# Altium schematic sheet ESP_AutoFlasher.SchDoc
size A4
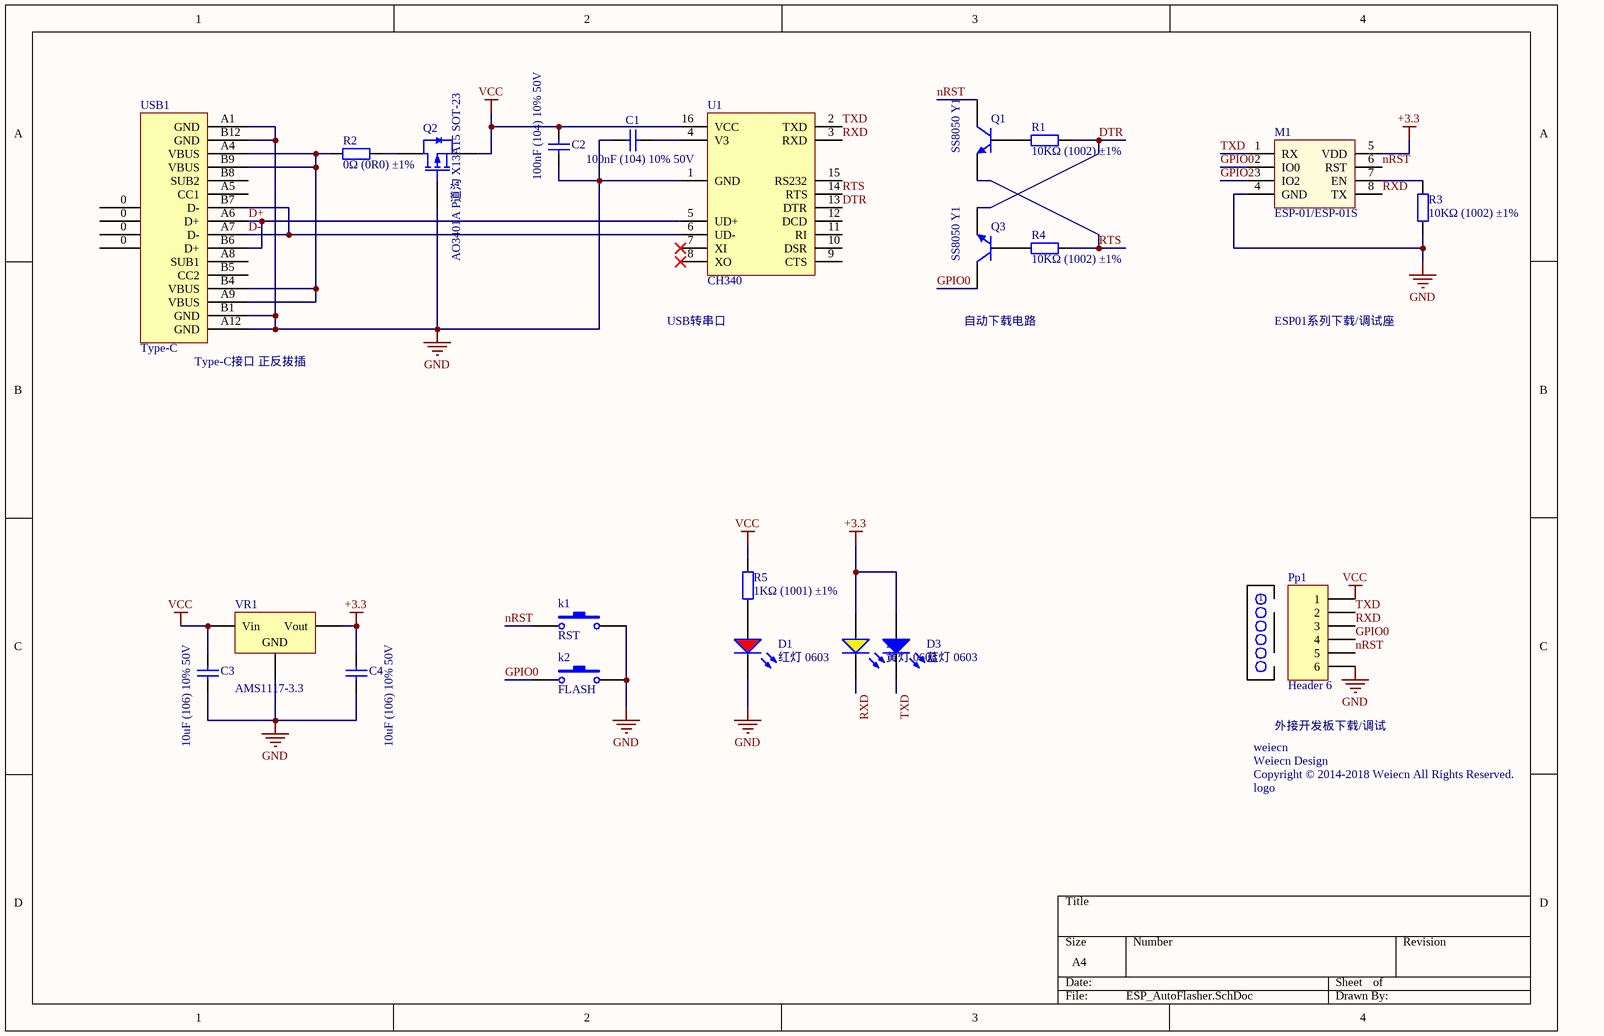
[diagram p0: ESP_AutoFlasher.SchDoc]

## Parts
C1  100nF (104) 10% 50V  [0603_C]
C2  100nF (104) 10% 50V  [0603_C]
C3  10uF (106) 10% 50V  [1206_C]
C4  10uF (106) 10% 50V  [1206_C]
D1  红灯 0603  [0603_LED_S1]
D2  黄灯 0603  [0603_LED_S1]
D3  蓝灯 0603  [0603_LED_S1]
k1  RST  [SW-3*4]
k2  FLASH  [SW-3*4]
M1  ESP-01/ESP-01S  [ESP-01&01S Module]
Pp1  Header 6  [6p]
Q1  SS8050 Y1  [SOT-23(SOT-23-3)]
Q2  AO3401A P道沟 X13A15 SOT-23  [SOT-23-3L]
Q3  SS8050 Y1  [SOT-23(SOT-23-3)]
R1  10KΩ (1002) ±1%  [0603_R]
R2  0Ω (0R0) ±1%  [0805_R]
R3  10KΩ (1002) ±1%  [0603_R]
R4  10KΩ (1002) ±1%  [0603_R]
R5  1KΩ (1001) ±1%  [0603_R]
U1  CH340  [SO_16]
USB1  Type-C  [Type-C_Socket_16P]
VR1  AMS1117-3.3  [SOT-223]
weiecn  logo  [Weiecn-LOGO]

## Nets
+3.3: C4.2 D2.A D3.A M1.5(VDD) VR1.2(Vout)
GND: C1.1 C2.1 C3.1 C4.1 D1.K k1.2 k2.2 M1.4(GND) Pp1.6 Q2.1(G) R3.1 U1.1(GND) USB1.A1(GND) USB1.A12(GND) USB1.B1(GND) USB1.B12(GND) VR1.1(GND)
VCC: C2.2 C3.2 Pp1.1 Q2.2(S) R5.2 U1.16(VCC) VR1.3(Vin)
D+: U1.5(UD+) USB1.A6(D+) USB1.B6(D+)
D-: U1.6(UD-) USB1.A7(D-) USB1.B7(D-)
DTR: Q3.2(E) R1.2 U1.13(DTR)
GPIO0: k2.1 M1.2(IO0) Pp1.4 Q3.3(C)
GPIO2: M1.3(IO2)
nRST: k1.1 M1.6(RST) Pp1.5 Q1.3(C)
RTS: Q1.2(E) R4.2 U1.14(RTS)
RXD: D2.K M1.8(TX) Pp1.3 U1.3(RXD)
TXD: D3.K M1.1(RX) Pp1.2 U1.2(TXD)
NetC1_2: C1.2 U1.4(V3)
NetD1_A: D1.A R5.1
NetM1_7: M1.7(EN) R3.2
NetQ1_1: Q1.1(B) R1.1
NetQ2_3: Q2.3(D) R2.2
NetQ3_1: Q3.1(B) R4.1
NetR2_1: R2.1 USB1.A4(VBUS) USB1.A9(VBUS) USB1.B4(VBUS) USB1.B9(VBUS)

Not connected (* = marked no-connect by the designer): U1 7(XI)* 8(XO)* 9(CTS) 10(DSR) 11(RI) 12(DCD) 15(RS232); USB1 0 A5(CC1) A8(SUB1) B5(CC2) B8(SUB2)

## Notes on the sheet
- (near USB1) Type-C接口 正反拔插
- USB转串口
- 自动下载电路
- ESP01系列下载/调试座
- 1
- 外接开发板下载/调试
- (in symbol logo) Weiecn Design; Copyright © 2014-2018 Weiecn All Rights Reserved.

## Library data of the parts
C1 C2 = 0603 100nF (104) 10% 50V: 贴片电容; ComponentLink1Description: 供应商链接; ComponentLink1URL: http://www.szlcsc.com/product/details_15331.html; Package: 0603; Supplier: LC; SuppliersPartNumber: C14663
C3 C4 = 1206 10uF (106) 10% 50V: 贴片电容; ComponentLink1Description: 供应商链接; ComponentLink1URL: http://www.szlcsc.com/product/details_14236.html; Package: 1206; Supplier: LC; SuppliersPartNumber: C13585
D1 = 0603 红灯: 发光二极管; ComponentLink1Description: 供应商链接; ComponentLink1URL: http://www.szlcsc.com/product/details_2659.html; Package: 0603; Supplier: LC; SuppliersPartNumber: C2286
D2 = 0603 黄灯: 发光二极管; ComponentLink1Description: 供应商链接; ComponentLink1URL: http://www.szlcsc.com/product/details_73147.html; Package: 0603; Supplier: LC; SuppliersPartNumber: C72038
D3 = 0603 蓝灯: 发光二极管; ComponentLink1Description: 供应商链接; ComponentLink1URL: http://www.szlcsc.com/product/details_73150.html; Package: 0603; Supplier: LC; SuppliersPartNumber: C72041
k1 k2 = SW: 按键
M1 = ESP-01&01S Module: ESP-01/ESP-01S 模块; ComponentLink1Description: ESP-01S; ComponentLink1URL: https://item.taobao.com/item.htm?id=543468772547; ComponentLink2Description: ESP-01; ComponentLink2URL: https://item.taobao.com/item.htm?id=543546250892
Pp1 = Header 6: Header, 6-Pin; LatestRevisionDate: 17-Jul-2002; LatestRevisionNote: Re-released for DXP Platform.; Publisher: Altium Limited
Q1 Q3 = SOT-23 SS8050 Y1: 三极管; ComponentLink1Description: 供应商链接; ComponentLink1URL: http://www.szlcsc.com/product/details_2507.html; Package: SOT-23; Supplier: LC; SuppliersPartNumber: C2150
Q2 = AO3401A P道沟 X13A15 SOT-23: MOS(场效应管); ComponentLink1Description: 供应商链接; ComponentLink1URL: http://www.szlcsc.com/product/details_15801.html; Package: SOT-23; Supplier: LC; SuppliersPartNumber: C15127
R1 R3 R4 = 0603 10KΩ (1002) 1%: 贴片电阻; ComponentLink1Description: 供应商链接; ComponentLink1URL: http://www.szlcsc.com/product/details_26547.html; Package: 0603; Supplier: LC; SuppliersPartNumber: C25804
R2 = 0805 0Ω (0R0) 1%: 贴片电阻; ComponentLink1Description: 供应商链接; ComponentLink1URL: http://www.szlcsc.com/product/details_18165.html; Package: 0805; Supplier: LC; SuppliersPartNumber: C17477
R5 = 0603 1KΩ (1001) 1%: 贴片电阻; ComponentLink1Description: 供应商链接; ComponentLink1URL: http://www.szlcsc.com/product/details_21904.html; Package: 0603; Supplier: LC; SuppliersPartNumber: C21190
USB1 = Type-C Socket: USB 3.1  单排16PIN四脚插板(L=7.35) 一体式MD; ComponentLink1Description: USB 3.1 C TYPE单排16PIN四脚插板(L=7.35) 一体式MD; ComponentLink1URL: https://item.szlcsc.com/293008.html
VR1 = SOT-223 AMS1117-3.3: 低压差线性稳压(LDO); ComponentLink1Description: 供应商链接; ComponentLink1URL: http://www.szlcsc.com/product/details_6652.html; Package: SOT-223; Supplier: LC; SuppliersPartNumber: C6186